# Altium schematic sheet ams-master.SchDoc: ams-master
size A4; Date: 05.10.2017; CheckedBy: UNCHECKED; Author: Leon Loeser; Organization: Baltic Racing; Address1: Zur Schwedenschanze 15; Address2: Haus 18; Address3: 18435 Stralsund; Revision: xx.xx; SheetNumber: 2; SheetTotal: 9; Rules: EV5.8; ProjectName: Projekt
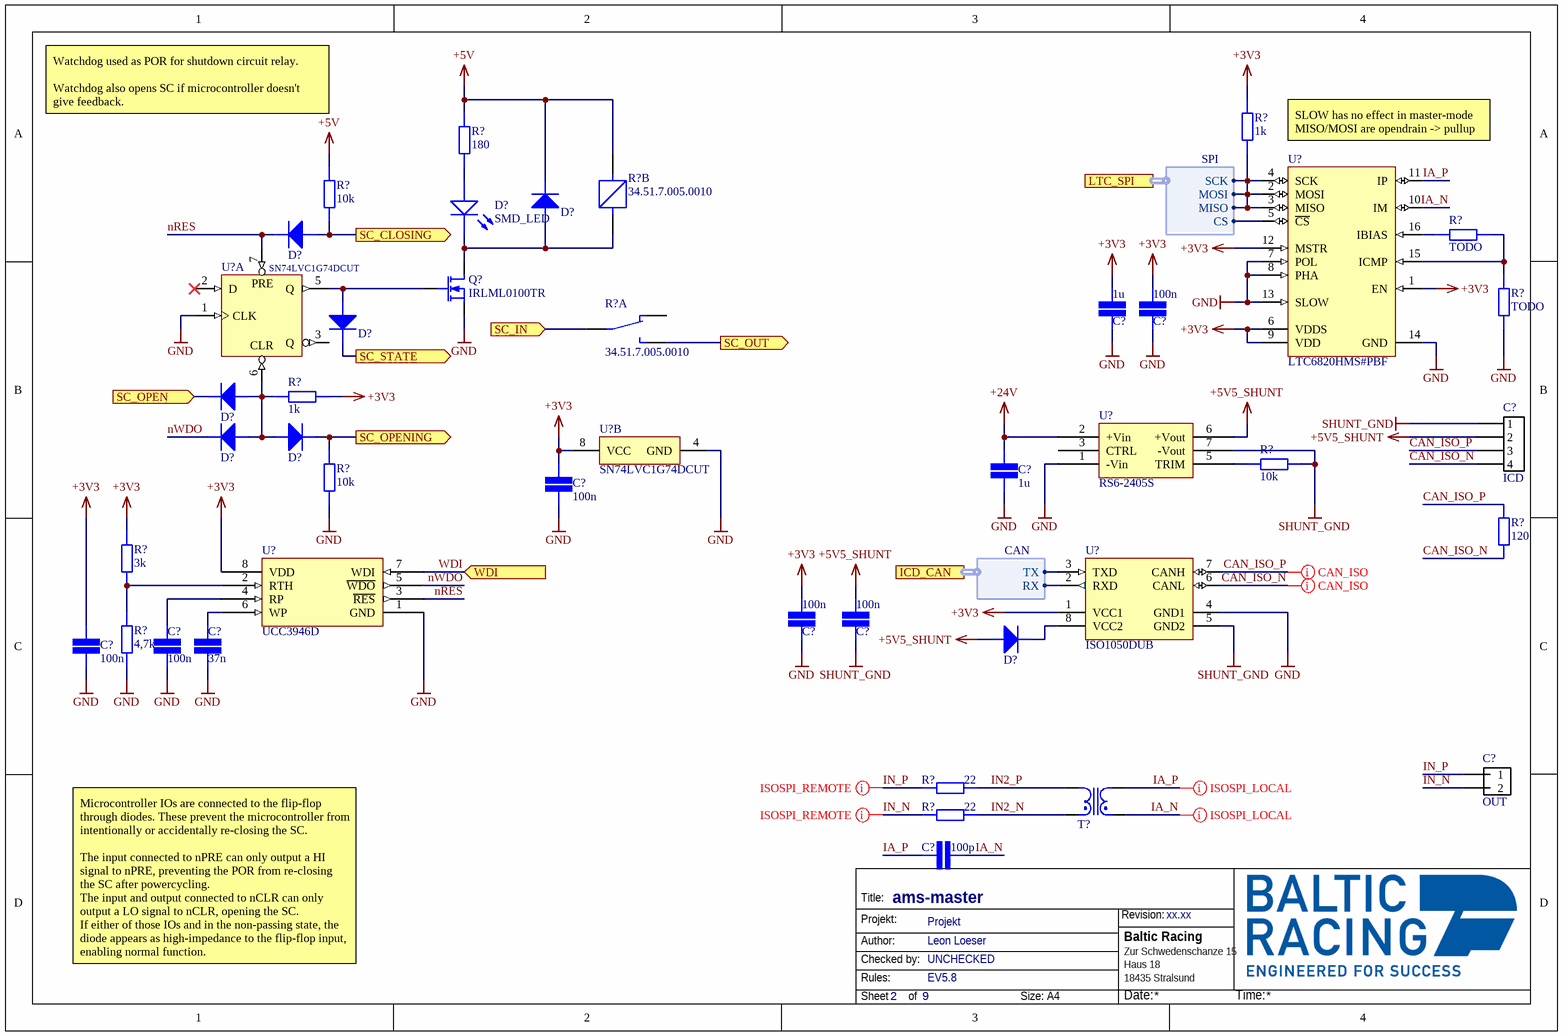
[diagram p0: ams-master.SchDoc]

## Parts
(Parts that share a designator on the sheet are numbered #1, #2 ... from top to bottom, then left to right.)
C?#1  value 1u  [CAP 1206/3216]  (hidden comment: SMD Capacitor)
C?#2  value 100n  [CAP 0603/1608]  (hidden comment: SMD Capacitor)
C?#3  ICD  [43650-0415]
C?#4  value 1u  [CAP 0805/2012]  (hidden comment: SMD Capacitor)
C?#5  value 100n  [CAP 0603/1608]  (hidden comment: SMD Capacitor)
C?#6  value 100n  [CAP 0603/1608]  (hidden comment: SMD Capacitor)
C?#7  value 100n  [CAP 0603/1608]  (hidden comment: SMD Capacitor)
C?#8  value 100n  [CAP 0603/1608]  (hidden comment: SMD Capacitor)
C?#9  value 100n  [CAP 0603/1608]  (hidden comment: SMD Capacitor)
C?#10  value 37n  [CAP 0603/1608]  (hidden comment: SMD Capacitor)
C?#11  OUT  [43045-0212]
C?#12  value 100p  [CAP 0603/1608]  (hidden comment: SMD Capacitor)
D?#1  BAS16HT  [SOD123F]  (value not drawn)
D?#2  SMD_LED  [SOT-23 - LED]
D?#3  BAS16HT  [SOD123F]  (value not drawn)
D?#4  BAS16HT  [SOD123F]  (value not drawn)
D?#5  BAS16HT  [SOD123F]  (value not drawn)
D?#6  BAS16HT  [SOD123F]  (value not drawn)
D?#7  BAS16HT  [SOD123F]  (value not drawn)
D?#8  BAS16HT  [SOD123F]  (value not drawn)
Q?  IRLML0100TR  [SOT23]
R?#1  value 1k  [STACKPOLE CSR0603]  (hidden comment: SMD Resistor)
R?#2  value 180  [STACKPOLE CSR0603]  (hidden comment: SMD Resistor)
R?#3  value 10k  [STACKPOLE CSR0603]  (hidden comment: SMD Resistor)
R?#4  34.51.7.005.0010  [FINDER_34.51.7.XXX.0010]  (part B of 2)
R?#5  value TODO  [STACKPOLE CSR0603]  (hidden comment: SMD Resistor)
R?#6  value TODO  [STACKPOLE CSR0603]  (hidden comment: SMD Resistor)
R?#7  34.51.7.005.0010  [FINDER_34.51.7.XXX.0010]  (part A of 2)
R?#8  value 1k  [STACKPOLE CSR0603]  (hidden comment: SMD Resistor)
R?#9  value 10k  [STACKPOLE CSR0603]  (hidden comment: SMD Resistor)
R?#10  value 10k  [STACKPOLE CSR0603]  (hidden comment: SMD Resistor)
R?#11  value 120  [STACKPOLE CSR0603]  (hidden comment: SMD Resistor)
R?#12  value 3k  [STACKPOLE CSR0603]  (hidden comment: SMD Resistor)
R?#13  value 4,7k  [STACKPOLE CSR0603]  (hidden comment: SMD Resistor)
R?#14  value 22  [STACKPOLE CSR0603]  (hidden comment: SMD Resistor)
R?#15  value 22  [STACKPOLE CSR0603]  (hidden comment: SMD Resistor)
T?  750110055  [Wuerth_750110055]  (value not drawn)
U?#1  LTC6820HMS#PBF  [LT-MS-16_M]
U?#2  SN74LVC1G74DCUT  [DCU0008A_L]  (part A of 2)
U?#3  SN74LVC1G74DCUT  [DCU0008A_L]  (part B of 2)
U?#4  RS6-2405S  [SIP8_Recom]
U?#5  ISO1050DUB  [DUB0008A_L]
U?#6  UCC3946D  [SOIC8]

## Ports
ICD_CAN (harness CAN), LTC_SPI (harness SPI), SC_CLOSING (out), SC_IN (in), SC_OPEN (in), SC_OPENING (out), SC_OUT (out), SC_STATE (out), WDI (in)

## Harnesses
SPI: SCK, MOSI, MISO, CS
CAN: TX, RX

## Nets
+3V3: C?#1.1 C?#2.1 C?#5.1 C?#6.1 C?#8.2 R?#1.2 R?#8.2 R?#12.1 U?#1.1(EN) U?#1.6(VDDS) U?#1.9(VDD) U?#1.12(MSTR) U?#3.8(VCC) U?#5.1(VCC1) U?#6.8(VDD)
+5V: D?#1.C R?#2.2 R?#3.1 R?#4.A1
+5V5_SHUNT: C?#3.2 C?#7.1 D?#8.A U?#4.6(+Vout)
+24V: C?#4.1 U?#4.2(+Vin)
GND: C?#1.2 C?#2.2 C?#4.2 C?#5.2 C?#6.2 C?#8.1 C?#9.1 C?#10.1 Q?.2(S) R?#6.1 R?#10.2 R?#13.2 U?#1.7(POL) U?#1.8(PHA) U?#1.13(SLOW) U?#1.14(GND) U?#2.1(CLK) U?#3.4(GND) U?#4.1(-Vin) U?#5.4(GND1) U?#6.1(GND)
SHUNT_GND: C?#3.1 C?#7.2 R?#9.1 U?#4.7(-Vout) U?#5.5(GND2)
CAN_ISO_N: C?#3.4 R?#11.1 U?#5.6(CANL)
CAN_ISO_P: C?#3.3 R?#11.2 U?#5.7(CANH)
IA_N: C?#12.2 T?.4 U?#1.10(IM)
IA_P: C?#12.1 T?.3 U?#1.11(IP)
IN2_N: R?#15.2 T?.1
IN2_P: R?#14.2 T?.2
IN_N: C?#11.2 R?#15.1
IN_P: C?#11.1 R?#14.1
nRES: D?#3.C U?#2.7(~{PRE}) U?#6.3(~{RES})
nWDO: D?#6.C U?#6.5(~{WDO})
SC_CLOSING: D?#3.A R?#3.2 ; port SC_CLOSING
SC_IN: R?#7.11 ; port SC_IN
SC_OPEN: D?#5.C ; port SC_OPEN
SC_OPENING: D?#7.C R?#10.1 ; port SC_OPENING
SC_OUT: R?#7.14 ; port SC_OUT
SC_STATE: D?#4.C ; port SC_STATE
WDI: U?#6.7(WDI) ; port WDI
NetC?#9_2: C?#9.2 U?#6.4(RP)
NetC?#10_2: C?#10.2 U?#6.6(WP)
NetD?#1_A: D?#1.A D?#2.C(Cathode) Q?.3(D) R?#4.A2
NetD?#2_A: D?#2.A(Anode) R?#2.1
NetD?#4_A: D?#4.A Q?.1(G) U?#2.5(Q)
NetD?#5_A: D?#5.A D?#6.A D?#7.A R?#8.1 U?#2.6(~{CLR})
NetD?#8_C: D?#8.C U?#5.8(VCC2)
NetR?#1_1: R?#1.1 U?#1.2(MOSI) U?#1.3(MISO) U?#1.4(SCK) ; port LTC_SPI.SCK, port LTC_SPI.MOSI, port LTC_SPI.MISO
NetR?#5_1: R?#5.1 R?#6.2 U?#1.15(ICMP)
NetR?#5_2: R?#5.2 U?#1.16(IBIAS)
NetR?#9_2: R?#9.2 U?#4.5(TRIM)
NetR?#12_2: R?#12.2 R?#13.1 U?#6.2(RTH)
NetU?#1_5: U?#1.5(~{CS}) ; port LTC_SPI.CS
NetU?#5_2: U?#5.2(RXD) ; port ICD_CAN.RX
NetU?#5_3: U?#5.3(TXD) ; port ICD_CAN.TX

Not connected (* = marked no-connect by the designer): R?#7 12; U?#2 2(D)* 3(Q); U?#4 3(CTRL)

## Layout directives
differential pair: CAN_ISO_N, CAN_ISO_P, IA_N, IA_P, IN_N, IN_P

## Notes on the sheet
- Watchdog used as POR for shutdown circuit relay.
  Watchdog also opens SC if microcontroller doesn't give feedback.
- SLOW has no effect in master-mode
  MISO/MOSI are opendrain -> pullup
- Microcontroller IOs are connected to the flip-flop through diodes. These prevent the microcontroller from intentionally or accidentally re-closing the SC.
  The input connected to nPRE can only output a HI signal to nPRE, preventing the POR from re-closing the SC after powercycling.
  The input and output connected to nCLR can only output a LO signal to nCLR, opening the SC.
  If either of those IOs and in the non-passing state, the diode appears as high-impedance to the flip-flop input, enabling normal function.
- Title:
- Projekt:
- Revision:
- Author:
- Rules:
- Checked by:
- Sheet
- of
- Size:
- A4
- Date:
- Time:
- (in symbol CMP-0859-00687-1, part A) PRE; CLR

## Library data of the parts
C?#1 C?#2 C?#4-C?#10 C?#12 = SMD Capacitor: Capacitor with multiple Footprints
C?#3 = MicroFit3.0 4-Pin: Molex Micro-Fit 3.0 4-Pin / 600V / 8.5V
C?#11 = MicroFit3.0 2-Pin: Molex MicroFit3.0 2-Pin
D?#1 D?#3-D?#8 = SMD Diode: pin to pad: A>1 C>2
Q? = MOSFET N: N-Channel MOSFET / RK7002BMT116: / 250mA, 60Vds, 20Vgs / IRLML0100TR: / 1.6A, 100Vds, 16Vgs
R?#1-R?#3 R?#5 R?#6 R?#8-R?#15 = SMD Resistor: Resistor with multiple footprints
R?#4 R?#7 = FINDER_34.51.7.XXX.001X: printrelay / 5V:   34.51.7.005.001X / 24V: 34.51.7.024.001X / X stands for: / 0: standing / 9: flat
T? = Wuerth_Transformer_750110055: Würth Toroid Transformer 1:1 70µH; Order Nr.: 750312504; Hersteller: Würth
U?#1 = CMP-0937-00009-1: IsoSPI Isolated Communication Interface, 2.7 to 5.5 V, -40 to 125 degC, 16-Pin MSOP (MS), Pb-Free; Manufacturer: Linear Technology; IO Supply Current: 1 uA Max.; IO Supply Voltage Range: 1.7 to 5.5 V; Receiver Input Resistance: 35 kOhm; VBIAS: 1.9 to 2.1 V; Supply Current, IDLE State: 2 uA; ComponentLink3Description: Package Specification; Mounting Technology: Surface Mount; ComponentLink2URL: http://cds.linear.com/docs/en/datasheet/6820fa.pdf; PackageVersion: Rev. A; PackageReference: MS-16; PackageDescription: 16-Pin Micro Small Outline Package, Body 4.039 x 3 mm, Pitch 0.5 mm; ComponentLink3URL: http://cds.linear.com/docs/en/packaging/05081669_A_MS16.pdf; DatasheetVersion: Rev. A; Power Supply: 2.7 to 5.5 V; ComponentLink1Description: Manufacturer URL; PartNumber: LTC6820HMS#PBF; Temperature Range (degC): -40 to 125; ComponentLink1URL: http://www.linear.com/; ComponentLink2Description: Datasheet
U?#2 U?#3 = CMP-0859-00687-1: Single Positive-Edge-Triggered D-Type Flip-Flop With Clear and Preset, DCU0008A, SMALL T&R; Schmitt Trigger: No; Technology Family: LVC; VCC(Min)(V): 1.65; F @ Nom Voltage(Max)(Mhz): 150; ICC @ Nom Voltage(Max)(mA): 0.01; Voltage(Nom)(V): 1.8,2.5,3.3,5; VCC(Max)(V): 5.5; Output Type: CMOS; Logic: True; tpd @ Nom Voltage(Max)(ns): 13.4,7.1,5.9,4.1; Input Type: CMOS/TTL; Output Drive (IOL/IOH)(Max)(mA): 32/-32; Rating: Catalog; Bits(#): 1; Operating Temperature Range(C): -40 to 125; PackageReference: DCU0008A; ComponentLink2Description: Datasheet; DatasheetVersion: SCES794E; Part Number: SN74LVC1G74; Sub-Family: D-Type Flip-Flop; ComponentLink1URL: http://www.ti.com/; PartNumber: SN74LVC1G74DCUT; ComponentLink2URL: http://www.ti.com/lit/ds/symlink/sn74lvc1g74.pdf; ComponentLink1Description: Manufacturer URL; 3-State Output: No
  U?#3: PartId: 2
U?#4 = RS6: Recom isolated DC/DC converter
U?#5 = CMP-0315-00094-2: Isolated CAN Transceiver, -55 to 105 degC, 8-pin SOP (DUB), Green (RoHS & no Sb/Br); Manufacturer: Texas Instruments; Rating: Catalog; Drivers Per Package: 1; Isolated: Yes; ComponentLink2URL: http://www.ti.com/litv/pdf/mpds247b; Eco-Plan: Green (RoHS & no Sb/Br); PackageReference: DUB0008A; PackageVersion: revC, May-2006; ComponentLink1Description: Datasheet; PartNumber: ISO1050DUB; SubFamily: CAN; DatasheetVersion: SLLS983E; PackageDescription: 8-Pin Small Outline Package 2.54 mm Pitch; ComponentLink2Description: Package Specification; ComponentLink1URL: http://www.ti.com/general/docs/lit/getliterature.tsp?genericPartNumber=ISO1050&fileType=pdf; Mounting Technology: Surface Mount
U?#6 = UCC3946: Microprocessor supervisor with watchdog timer